# EAGLE design femtoduino (EAGLE 7.6.0)
VERSION: 1.01
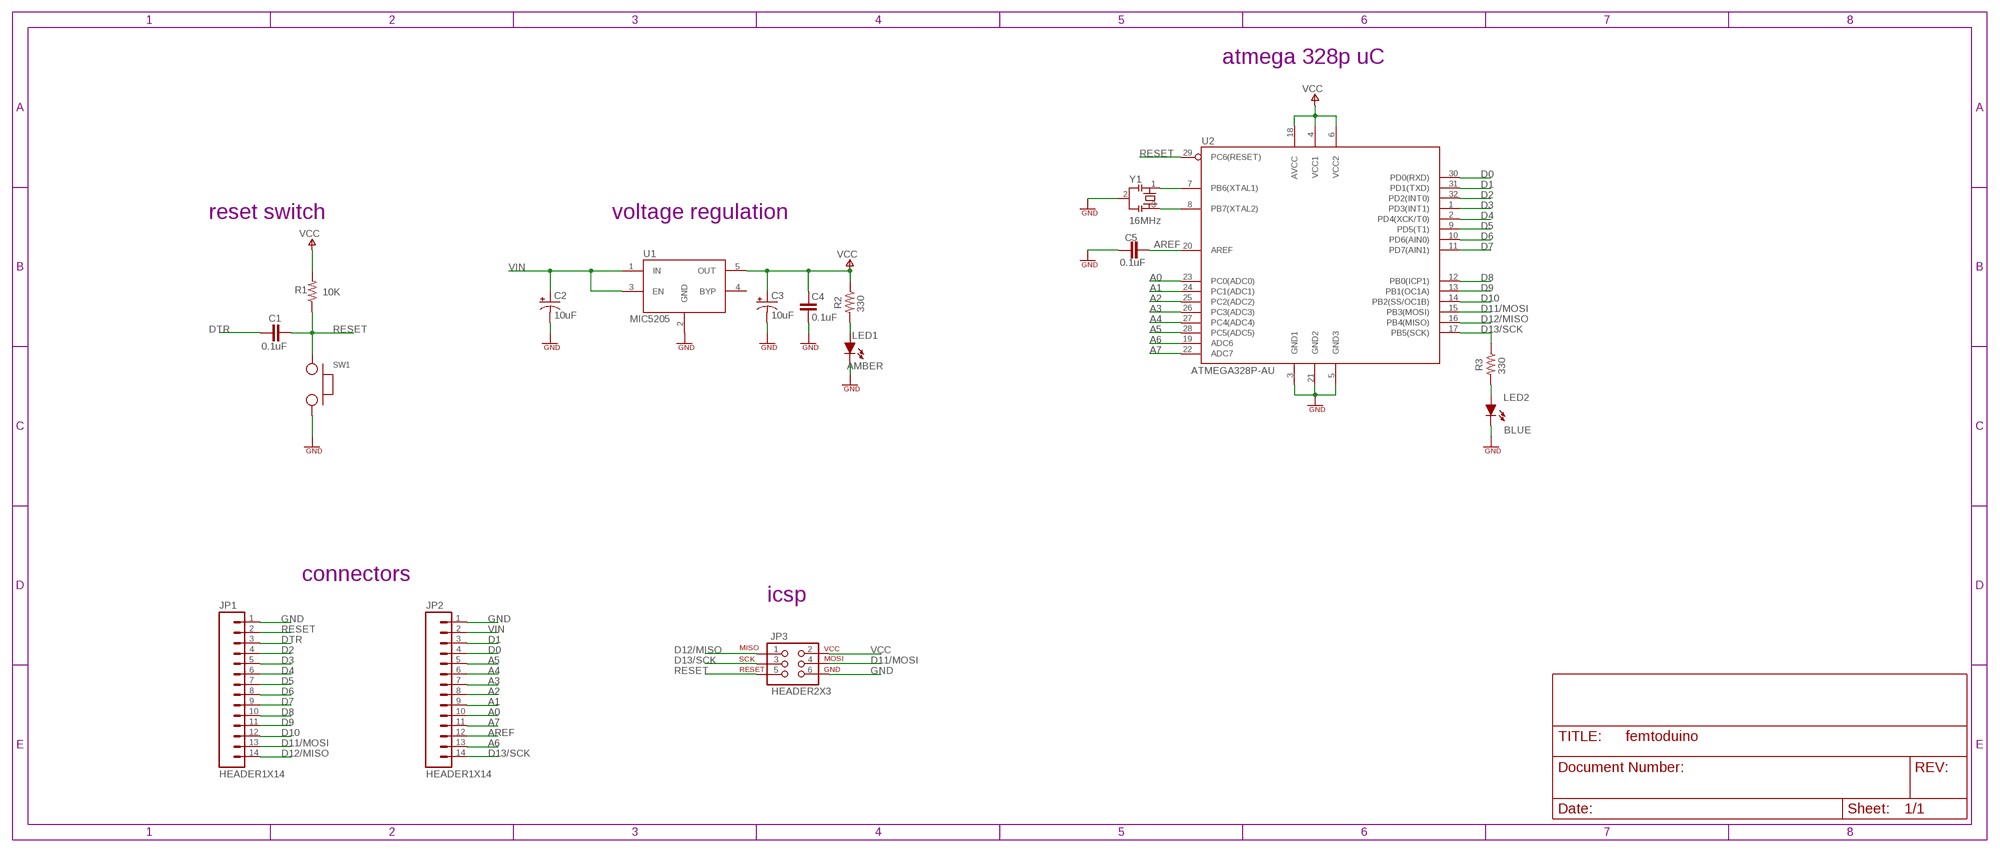
[diagram p0: schematic, sheet 1]

## Parts
C1  0.1uF  CAP_0603  [SMD0603]
C2  10uF  CAP_TANT  [EIA3216]
C3  10uF  CAP_TANT  [EIA3216]
C4  0.1uF  CAP_0603  [SMD0603]
C5  0.1uF  CAP_0603  [SMD0603]
JP1  HEADER1X14  [1X14]
JP2  HEADER1X14  [1X14]
JP3  HEADER2X3  [2X3]
LED1  AMBER  LED_0603  [LED_0603]
LED2  BLUE  LED_0603  [LED_0603]
R1  10K  RES_0603  [SMD0603]
R2  330  RES_0603  [SMD0603]
R3  330  RES_0603  [SMD0603]
SW1  SWITCH  [SWITCH-SPST]
U1  MIC5205  [SOT23-5]
U2  ATMEGA328P-AU  [TQFP32]
Y1  16MHz  CSTCE  [CSTCE]

## Nets
A0: JP2.10 U2.23(PC0(ADC0))
A1: JP2.9 U2.24(PC1(ADC1))
A2: JP2.8 U2.25(PC2(ADC2))
A3: JP2.7 U2.26(PC3(ADC3))
A4: JP2.6 U2.27(PC4(ADC4))
A5: JP2.5 U2.28(PC5(ADC5))
A6: JP2.13 U2.19(ADC6)
A7: JP2.11 U2.22(ADC7)
AREF: C5.1 JP2.12 U2.20(AREF)
D0: JP2.4 U2.30(PD0(RXD))
D1: JP2.3 U2.31(PD1(TXD))
D2: JP1.4 U2.32(PD2(INT0))
D3: JP1.5 U2.1(PD3(INT1))
D4: JP1.6 U2.2(PD4(XCK/T0))
D5: JP1.7 U2.9(PD5(T1))
D6: JP1.8 U2.10(PD6(AIN0))
D7: JP1.9 U2.11(PD7(AIN1))
D8: JP1.10 U2.12(PB0(ICP1))
D9: JP1.11 U2.13(PB1(OC1A))
D10: JP1.12 U2.14(PB2(SS/OC1B))
D11/MOSI: JP1.13 JP3.4 U2.15(PB3(MOSI))
D12/MISO: JP1.14 JP3.1 U2.16(PB4(MISO))
D13/SCK: JP2.14 JP3.3 R3.1 U2.17(PB5(SCK))
DTR: C1.1 JP1.3
GND: C2.C(-) C3.C(-) C4.2 C5.2 JP1.1 JP2.1 JP3.6 LED1.C LED2.C SW1.2 U1.2(GND) U2.3(GND1) U2.5(GND3) U2.21(GND2) Y1.2
N$1: LED1.A R2.2
N$2: U2.7(PB6(XTAL1)) Y1.1
N$3: U2.8(PB7(XTAL2)) Y1.3
N$5: LED2.A R3.2
RESET: C1.2 JP1.2 JP3.5 R1.1 SW1.1 U2.29(PC6(RESET))
VCC: C3.A(+) C4.1 JP3.2 R1.2 R2.1 U1.5(OUT) U2.4(VCC1) U2.6(VCC2) U2.18(AVCC)
VIN: C2.A(+) JP2.2 U1.1(IN) U1.3(EN)
Unconnected: U1.4(BYP)

## Notes on the sheet
- atmega 328p uC
- reset switch | voltage regulation
- connectors
- icsp

## Library data of the parts
C1 C4 C5 = eagle-book:CAP: Non-polarized capacitor
C2 C3 = eagle-book:CAP_TANT: Polarized capacitor (Tantalum)
JP1 JP2 = eagle-book:HEADER1X14: 14-pin header with pins spaced 0.1" apart
JP3 = eagle-book:HEADER2X3: 6-pin header with pins spaced 0.1" apart (HEADD6)
LED1 LED2 = eagle-book:LED: Light Emitting Diode
R1-R3 = eagle-book:RES: Resistor
SW1 = eagle-book:SWITCH: Two-input single pole, single throw (SPST) switch
U1 = eagle-book:MIC5205: 5-volt voltage regulator (UA78M05)
U2 = eagle-book:ATMEGA328P: Atmel 32-pin 8-bit microcontroller
Y1 = eagle-book:CSTCE: SMD resonator from Murata (CSTCE16M0V53-S0)

## Net classes
0 default: width 0.203 mm
1 VCC: width 0.305 mm, drill 0.406 mm
2 VIN: width 0.305 mm, drill 0.406 mm
3 AREF: width 0.254 mm, drill 0.406 mm
4 GND: width 0.254 mm, drill 0.406 mm

## Board
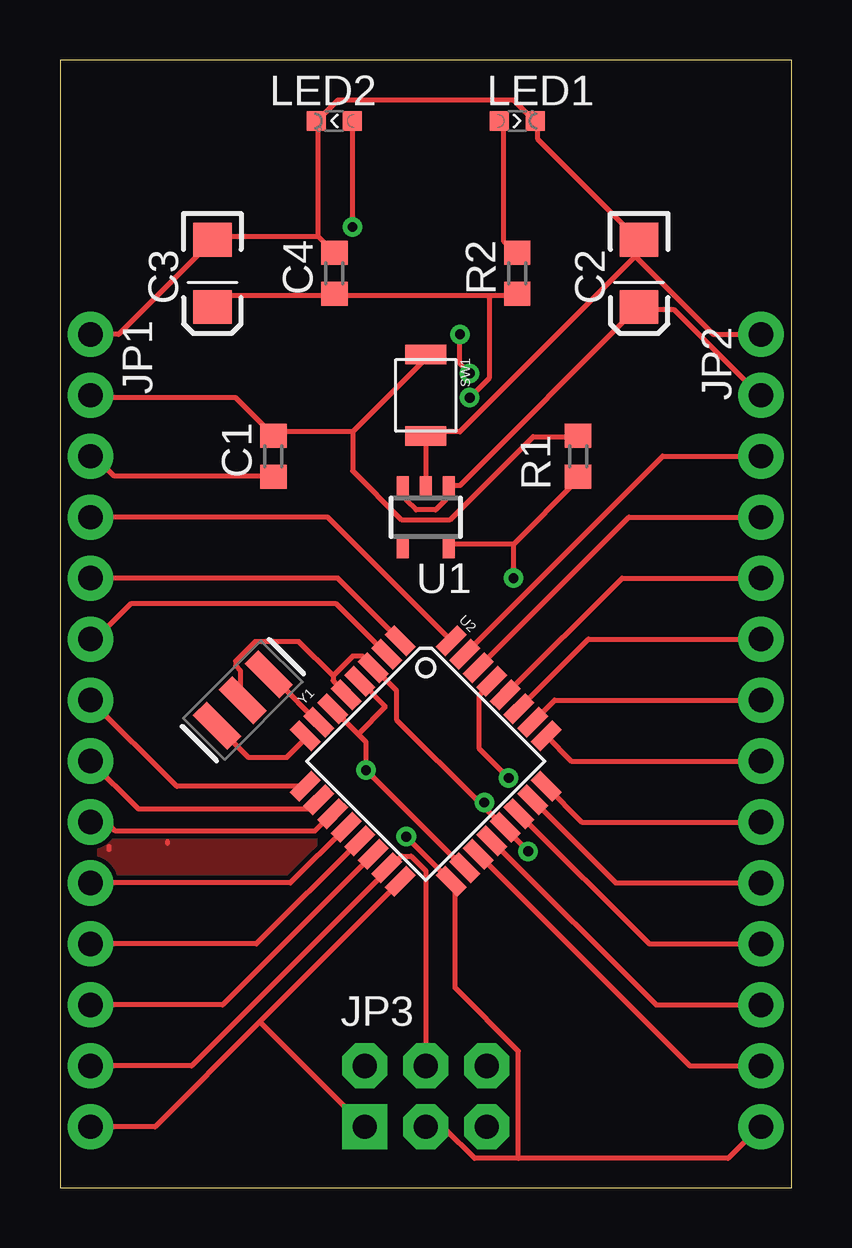
[diagram p1: board, top side]
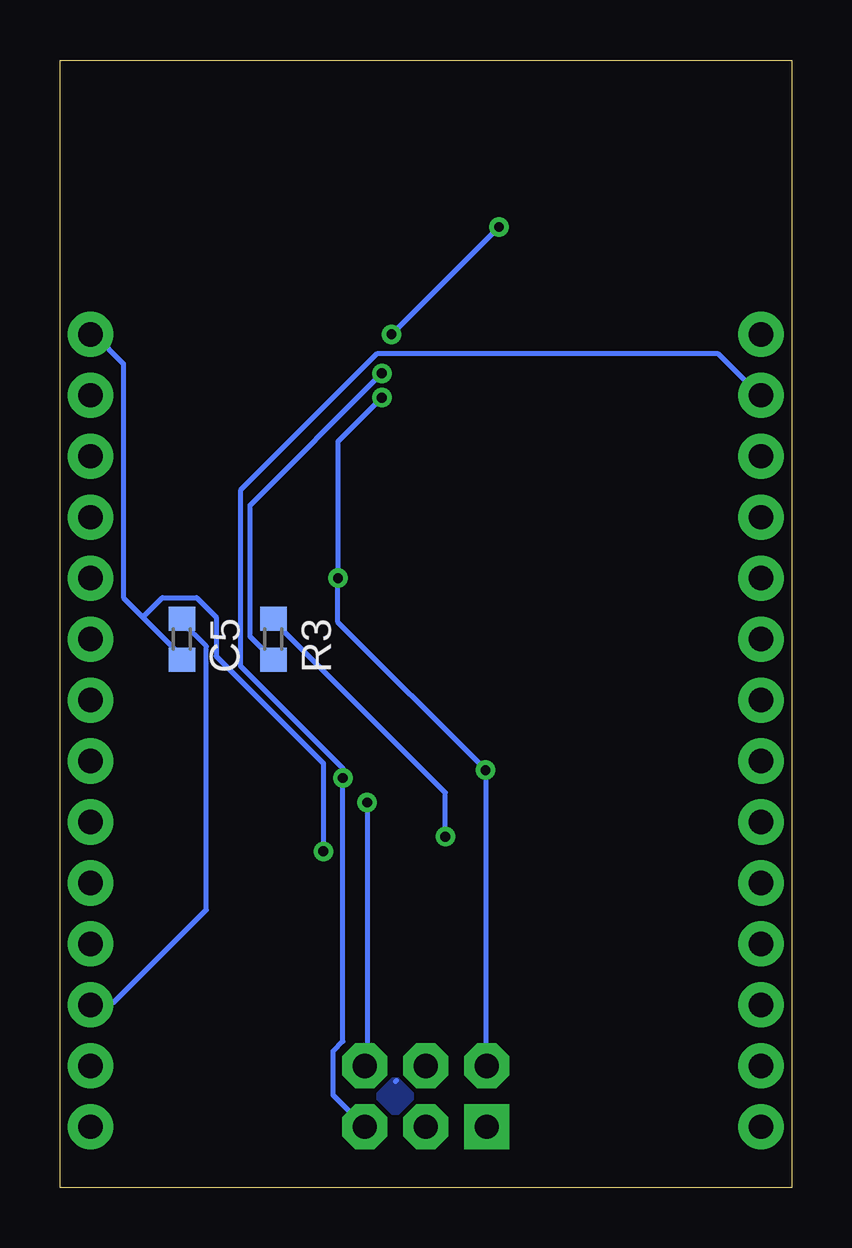
[diagram p2: board, bottom side, seen from below]

Size 30.48 x 46.99 mm. Coordinates in mm from the lower left corner, seen from the top.
Outline: 0,0 30.48,0 30.48,46.99 0,46.99 0,0
Copper layers (1*16): Top 0.035mm / dielectric 1.5mm / Bottom 0.035mm
Design rules "femtoduino": minimum track width 8mil, minimum drill 16mil, track to track 8mil, track to pad 8mil, pad to pad 8mil, via to via 8mil, smd to smd 8mil, copper to edge 8mil, drill to drill 8mil, minimum pad ring 10mil, minimum via ring 8mil, stop-mask expansion 4mil, vias tented up to drill 0mil, thermal gap 10mil

### Footprints (pad centres in the part's own frame; a part is rotated, then mirrored left to right if it is on the bottom)
SMD0603 = smd 1 x 1.1: 1 -0.85,0; 2 0.85,0
EIA3216 = smd 1.4 x 1.6: A 1.4,0; C -1.4,0
1X14 = drill 1.016 pad 1.88: 1 0,0; 2 2.54,0; 3 5.08,0; 4 7.62,0; 5 10.16,0; 6 12.7,0; 7 15.24,0; 8 17.78,0; 9 20.32,0; 10 22.86,0; 11 25.4,0; 12 27.94,0; 13 30.48,0; 14 33.02,0
2X3 = drill 1.016 pad 1.88 square: 1 -2.54,-1.27 | drill 1.016 pad 1.88 octagon: 2 -2.54,1.27; 3 0,-1.27; 4 0,1.27; 5 2.54,-1.27; 6 2.54,1.27
LED_0603 = smd 0.8 x 0.8: A 0,-0.75; C 0,0.75
SWITCH-SPST = smd 0.8 x 1.7: 1 -1.7,0; 2 1.7,0
SOT23-5 = smd 0.5 x 1: 1 -0.95,-1.2; 2 0,-1.2; 3 0.95,-1.2; 4 0.95,1.2; 5 -0.95,1.2
TQFP32 = smd 1.27 x 0.559: 1 -4.293,2.8; 2 -4.293,2; 3 -4.293,1.2; 4 -4.293,0.4; 5 -4.293,-0.4; 6 -4.293,-1.2; 7 -4.293,-2; 8 -4.293,-2.8; 17 4.293,-2.8; 18 4.293,-2; 19 4.293,-1.2; 20 4.293,-0.4; 21 4.293,0.4; 22 4.293,1.2; 23 4.293,2; 24 4.293,2.8 | smd 0.559 x 1.27: 9 -2.8,-4.293; 10 -2,-4.293; 11 -1.2,-4.293; 12 -0.4,-4.293; 13 0.4,-4.293; 14 1.2,-4.293; 15 2,-4.293; 16 2.8,-4.293; 25 2.8,4.293; 26 2,4.293; 27 1.2,4.293; 28 0.4,4.293; 29 -0.4,4.293; 30 -1.2,4.293; 31 -2,4.293; 32 -2.8,4.293
CSTCE = smd 0.8 x 2.032: 1 -1.524,0; 2 0,0; 3 1.524,0

### Placement (x,y rotation side)
C1  8.89,30.48 90 top
C2  24.13,38.1 270 top
C3  6.35,38.1 270 top
C4  11.43,38.1 90 top
C5  25.4,22.86 270 bottom
JP1  1.27,35.56 270 top
JP2  29.21,35.56 270 top
JP3  15.24,3.81 0 top
LED1  19.05,44.45 270 top
LED2  11.43,44.45 90 top
R1  21.59,30.48 270 top
R2  19.05,38.1 90 top
R3  21.59,22.86 270 bottom
SW1  15.24,33.02 270 top
U1  15.24,27.94 180 top
U2  15.24,17.78 315 top
Y1  7.62,20.32 225 top

### Tracks (layer width: path | path; a pad name or v marks a point on that pad's centre or on a via)
A0
  Top 0.203: U2.23 23.15,12.7 JP2.10
A1
  Top 0.203: U2.24 21.74,15.24 JP2.9
A2
  Top 0.203: U2.25 21.31,17.78 JP2.8
A3
  Top 0.203: U2.26 20.61,20.32 JP2.7
A4
  Top 0.203: U2.27 22.02,22.86 JP2.6
A5
  Top 0.203: U2.28 23.43,25.4 JP2.5
A6
  Top 0.203: U2.19 26.24,5.08 JP2.13
A7
  Top 0.203: U2.22 24.56,10.16 JP2.11
AREF
  Top 0.203: U2.20 24.83,7.62 JP2.12
  Bottom 0.203: C5.1 25.4,23.57 24.38,22.55 24.38,11.58 28.25,7.72 29.06,7.72 JP2.12
D0
  Top 0.203: U2.30 23.7,27.94 JP2.4
D1
  Top 0.203: U2.31 25.11,30.48 JP2.3
D2
  Top 0.203: U2.32 11.15,27.94 JP1.4
D3
  Top 0.203: U2.1 11.58,25.4 JP1.5
D4
  Top 0.203: U2.2 11.52,24.33 2.95,24.33 1.47,22.86 JP1.6
D5
  Top 0.203: U2.9 4.87,16.73 JP1.7
D6
  Top 0.203: U2.10 10.41,15.77 3.28,15.77 JP1.8
D7
  Top 0.203: U2.11 10.62,14.86 2.31,14.86 1.93,15.24 JP1.9
D8
  Top 0.203: U2.12 9.59,12.7 JP1.10
D9
  Top 0.203: U2.13 8.19,10.16 JP1.11
D10
  Top 0.203: U2.14 6.78,7.62 JP1.12
D11/MOSI
  Top 0.203: JP1.13 5.49,5.08 13.61,13.21 U2.15 13.82,13.41 14.22,13.82 14.63,13.82 15.24,13.21 JP3.4
D12/MISO
  Top 0.203: U2.16 8.33,6.91 | 8.33,6.91 3.96,2.54 JP1.14 | 8.33,6.91 JP3.1
D13/SCK  (via drill 0.41)
  Top 0.203: v14.43,14.63 16.26,12.8 U2.17 16.46,12.6 16.46,8.33 19.1,5.69 19.1,1.22 | 19.1,1.22 27.84,1.22 29.06,2.44 JP2.14 | 19.1,1.22 17.27,1.22 16.05,2.44 15.24,2.44 JP3.3
  Bottom 0.203: v14.43,14.63 14.43,16.46 21.54,23.57 R3.1
DTR
  Top 0.203: C1.1 8.74,29.67 2.23,29.67 1.42,30.48 JP1.3
GND  (via drill 0.41)
  Top 0.203: 11.38,21.34 11.38,21.13 11.79,20.73 U2.5 | 11.38,21.34 12.19,22.15 12.6,22.15 13.01,21.74 U2.3 13.21,21.54 14.02,20.73 14.02,19.51 17.48,16.05 | 17.48,16.05 18.49,15.04 U2.21 18.69,14.83 v19.51,14.02 | 11.38,21.34 9.96,22.76 8.13,22.76 7.32,21.95 7.32,21.74 7.52,21.54 7.52,20.32 Y1.2 | 17.48,16.05 v17.68,16.05 | 10.77,39.62 10.77,44.3 LED2.C 10.77,44.5 11.58,45.31 18.9,45.31 19.71,44.5 LED1.C 19.91,44.3 19.91,43.69 23.98,39.62 C2.C | 10.77,39.62 11.38,39.01 C4.2 | 10.77,39.62 6.5,39.62 C3.C 6.3,39.42 2.44,35.56 JP1.1 | U1.2 SW1.2 15.24,31.5 16.66,31.5 23.98,38.81 | 23.98,38.81 23.98,39.42 C2.C | JP2.1 27.23,35.56 23.98,38.81 | 23.98,38.81 C2.C
  Bottom 0.203: v17.68,16.05 17.68,5.08 JP3.6 | 27.03,23.77 27.84,24.59 27.84,34.34 29.06,35.56 JP2.1 | 27.03,23.77 25.4,22.15 C5.2 | v19.51,14.02 19.51,17.68 23.98,22.15 23.98,23.77 24.79,24.59 26.21,24.59 27.03,23.77
N$1
  Top 0.203: LED1.A 18.49,44.3 18.49,39.42 18.9,39.01 R2.2
N$2
  Top 0.203: U2.7 10.75,19.4 9.09,21.06 9.04,21.06 Y1.1
N$3
  Top 0.203: Y1.3 7.85,17.93 9.45,17.93 10.22,18.71 U2.8
N$4
  Top 0.203: 4.47,14.43 4.47,14.35 | 2.03,14.22 2.03,14.1
  pour Top: 0.25,46.74 0.25,0.25 30.23,0.25 30.23,46.74
N$5  (via drill 0.41)
  Top 0.203: v12.19,40.03 12.19,44.3 LED2.A | v16.66,35.56 16.66,34.34 v17.07,33.93
  Bottom 0.203: v16.66,35.56 v12.19,40.03 | v17.07,33.93 22.55,28.45 22.55,22.96 21.74,22.15 R3.2
N$6
  Bottom 0.203: 16.46,4.47 16.5,4.43
  pour Bottom: 0.25,46.74 0.25,0.25 30.23,0.25 30.23,46.74
RESET  (via drill 0.41)
  Top 0.203: v18.69,17.07 17.48,18.29 17.48,20.52 17.88,20.93 U2.29 | 12.19,31.5 8.94,31.5 C1.2 8.74,31.5 7.32,32.92 1.42,32.92 JP1.2 | 12.19,31.5 15.24,34.54 SW1.1 | 12.19,31.5 12.19,29.87 14.22,27.84 16.26,27.84 19.71,31.29 21.54,31.29 R1.1
  Bottom 0.203: JP3.5 19.1,3.86 19.1,5.69 18.69,6.1 v18.69,17.07 18.69,17.48 22.96,21.74 22.96,29.06 17.27,34.75 3.05,34.75 1.42,33.12 JP1.2
VCC  (via drill 0.41)
  Top 0.203: U2.18 16.82,13.33 v12.75,17.4 12.75,18.57 12.42,18.9 | U2.4 12.51,21.1 13.54,20.07 13.54,20.02 12.42,18.9 | 12.42,18.9 U2.6 | 18.9,26.82 16.26,26.82 U1.5 | 18.9,26.82 21.54,29.46 R1.2 | v18.9,25.4 18.9,26.82 | C3.A 6.5,36.78 6.91,37.19 11.38,37.19 C4.1 11.58,37.19 17.88,37.19 | 17.88,37.19 18.9,37.19 R2.1 | v17.07,32.92 17.88,33.73 17.88,37.19
  Bottom 0.203: JP3.2 12.75,5.13 v12.75,17.4 12.8,17.48 18.9,23.57 v18.9,25.4 18.9,31.09 v17.07,32.92
VIN
  Top 0.203: U1.3 14.43,29.06 14.43,28.65 14.83,28.25 15.65,28.25 16.05,28.65 16.05,29.06 U1.1 16.26,29.26 16.66,29.26 23.98,36.58 C2.A 24.18,36.58 25.6,36.58 29.06,33.12 JP2.2